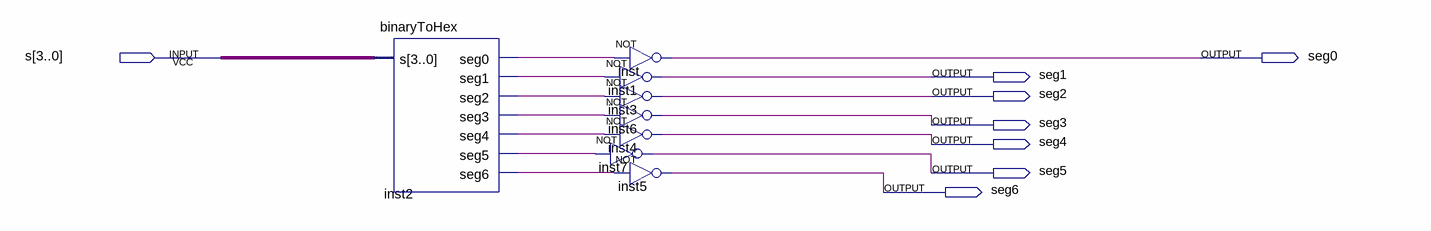
[diagram p0: schematic sheet]
// Quartus schematic hexDriver.bdf as structural Verilog: 8 symbols, 8 pins
module hexDriver (
  input  [3:0] s,
  output seg0,
  output seg1,
  output seg2,
  output seg3,
  output seg4,
  output seg5,
  output seg6
);

  wire inst2_seg0, inst2_seg1, inst2_seg2, inst2_seg3, inst2_seg4, inst2_seg5, inst2_seg6;

  binaryToHex inst2 (
    .s(s), .seg0(inst2_seg0), .seg1(inst2_seg1), .seg2(inst2_seg2), .seg3(inst2_seg3), .seg4(inst2_seg4),
    .seg5(inst2_seg5), .seg6(inst2_seg6));
  not inst1 (seg1, inst2_seg1);
  not inst3 (seg2, inst2_seg2);
  not inst6 (seg3, inst2_seg3);
  not inst4 (seg4, inst2_seg4);
  not inst7 (seg5, inst2_seg5);
  not inst (seg0, inst2_seg0);
  not inst5 (seg6, inst2_seg6);
endmodule
